# Altium schematic sheet Current_measurement_circuit.SchDoc
size A4; SheetNumber: 6; SheetTotal: 6
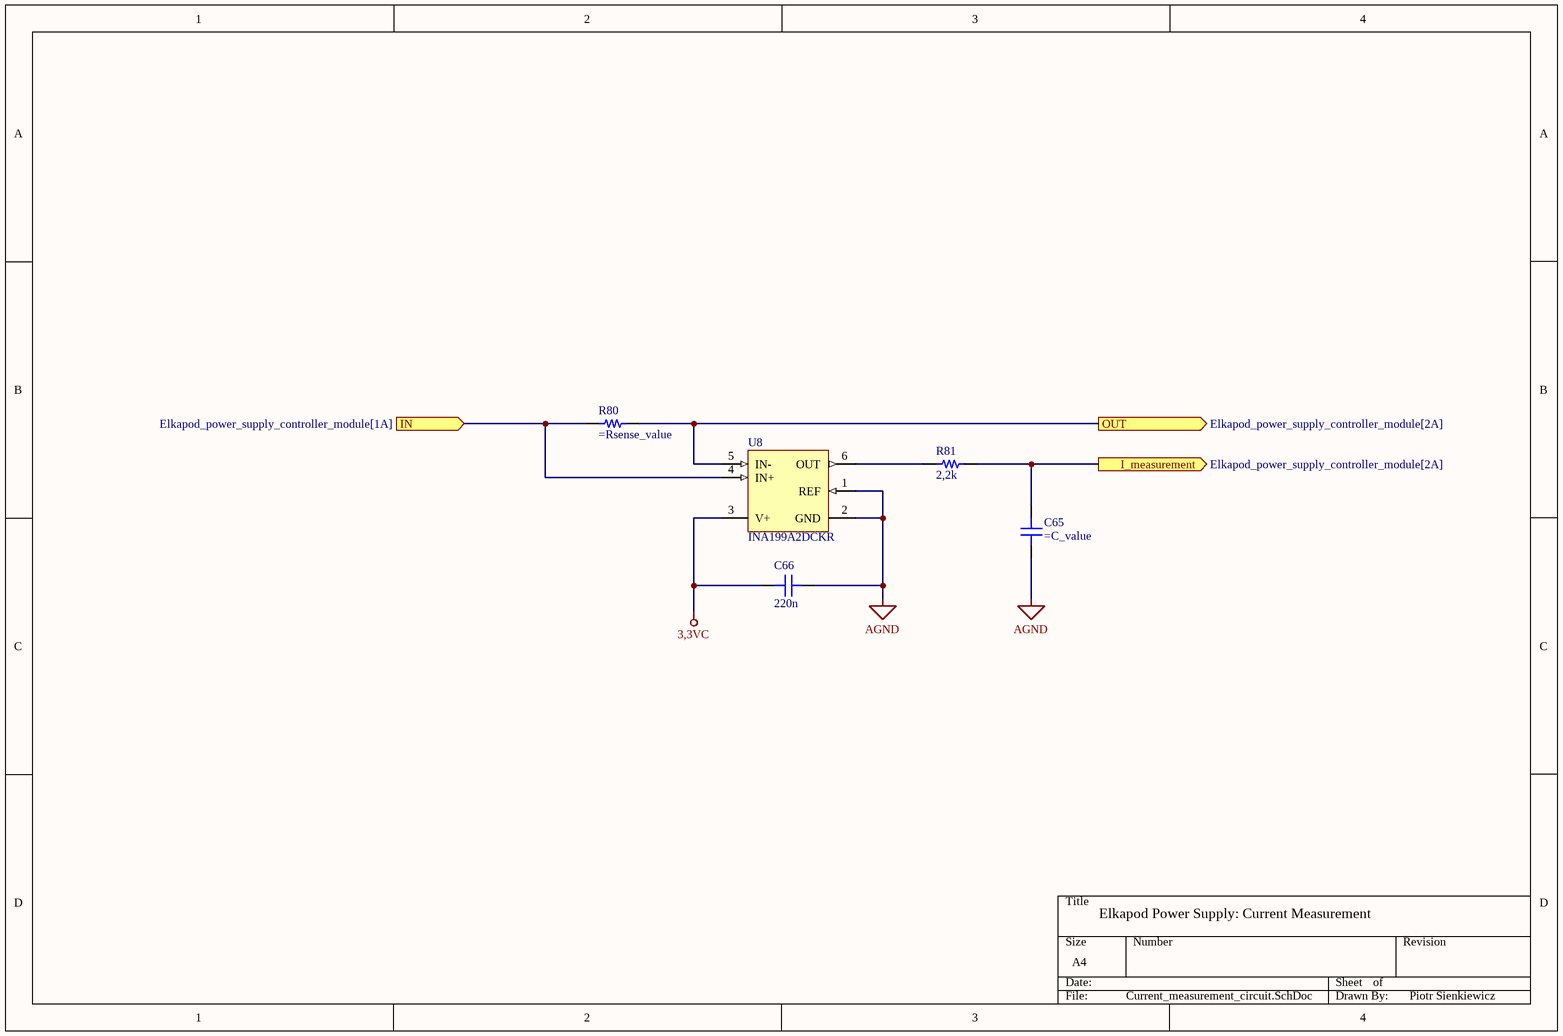
[diagram p0: Current_measurement_circuit.SchDoc]

## Parts
C65  (no value)  [CAP 0603_1608]
C66  220n  [CAP 0603_1608]
R80  (no value)  [STACKPOLE CSM2512]
R81  2,2k  [RES 0603_1608]
U8  INA199A2DCKR  [DCK0006A_N]

## Ports
I_measurement (out, see Elkapod_power_supply_controller_module[2A]), IN (in, see Elkapod_power_supply_controller_module[1A]), OUT (out, see Elkapod_power_supply_controller_module[2A])

## Nets
3,3VC: C66.2 U8.3(V+)
AGND: C65.1 C66.1 U8.1(REF) U8.2(GND)
I_measurement: C65.2 R81.2 ; port I_measurement
IN: R80.2 U8.4(IN+) ; port IN
OUT: R80.1 U8.5(IN-) ; port OUT
NetR81_1: R81.1 U8.6(OUT)

## Notes on the sheet
- Elkapod Power Supply: Current Measurement
- Piotr Sienkiewicz

## Library data of the parts
C65 = C0603C272F3GAC7867: CAP CER ??uF 35V X5R 0603; manufacturer: KEMET; Temperature Coefficient: C0G, NP0; Tolerance: ±1%; Voltage - Rated: 25V; Part Number: C0603C272F3GAC7867; Value: =C_value; Applications: General Purpose; Capacitance: =C_value; componentlink1description: Datasheet; componentlink1url: https://api.kemet.com/component-edge/download/datasheet/C0603C272F3GACTU.pdf; componentlink2description: DigiKey Link; componentlink2url: https://www.digikey.com/en/products/detail/kemet/C0603C272F3GAC7867/2200413; Device Package: 0603 (1608 Metric); Features: Low ESL; lastupdated: 09.02.2024 20:10:30; Lifecycle Status: Active; Minimum Order: 1; Mounting Type: Surface Mount, MLCC; Operating Temperature: -55°C ~ 125°C; Package / Case: 0603 (1608 Metric); packaging: TapeAndReel; partid: 2138; Part Status: Active; price: 0.40; series: SMD Comm C0G; Size / Dimension: 0.063" L x 0.031" W (1.60mm x 0.80mm); Thickness (Max): 0.034" (0.87mm)
C66 = C0603C272F3GAC7867: CAP CER 220nF 25V X5R 0603; manufacturer: KEMET; Temperature Coefficient: C0G, NP0; Tolerance: ±1%; Part Number: C0603C272F3GAC7867; Value: 220n; Applications: General Purpose; Capacitance: 220n; componentlink1description: Datasheet; componentlink1url: https://api.kemet.com/component-edge/download/datasheet/C0603C272F3GACTU.pdf; componentlink2description: DigiKey Link; componentlink2url: https://www.digikey.com/en/products/detail/kemet/C0603C272F3GAC7867/2200413; Device Package: 0603 (1608 Metric); Features: Low ESL; lastupdated: 09.02.2024 20:10:30; Lifecycle Status: Active; Minimum Order: 1; Mounting Type: Surface Mount, MLCC; Operating Temperature: -55°C ~ 125°C; Package / Case: 0603 (1608 Metric); packaging: TapeAndReel; partid: 2138; Part Status: Active; price: 0.40; series: SMD Comm C0G; Size / Dimension: 0.063" L x 0.031" W (1.60mm x 0.80mm); Thickness (Max): 0.034" (0.87mm); Voltage - Rated: 25V
R80 = CSM2512FT20L0: RES 1% 3W 2512; manufacturer: Stackpole Electronics Inc; Temperature Coefficient: ±50ppm/°C; value: 20 mOhms; Part Number: CSM2512FT20L0; componentlink1description: Datasheet; componentlink1url: https://www.seielect.com/Catalog/SEI-CSM.PDF; componentlink2description: DigiKey Link; componentlink2url: https://www.digikey.com/en/products/detail/stackpole-electronics-inc/CSM2512FT20L0/6270239; Composition: Metal Element; Device Package: 2512 (6332 Metric); Features: Current Sense; Height - Seated (Max): 0.035" (0.90mm); lastupdated: 03.06.2024 20:27:03; Lifecycle Status: Active; Minimum Order: 4000; Number of Terminations: 2; Operating Temperature: -55°C ~ 170°C; Package / Case: 2512 (6332 Metric); packaging: TapeAndReel; Part Status: Active; Power (Watts): 3W; price: 0.19; Resistance: =Rsense_value; series: CSM; Size / Dimension: 0.252" L x 0.126" W (6.40mm x 3.20mm); Supplier Device Package: 2512; Tolerance: ±1%
R81 = RNCS0603BKE10K0: RES 2,2K OHM 1% 0,1W 0603; Manufacturer: Stackpole Electronics Inc; Power (Watts): 0.063W, 1/16W; Temperature Coefficient: ±25ppm/°C; Tolerance: ±0.1%; Part Number: RNCS0603BKE10K0; Value: 2,2k; Composition: Thin Film; Device Package: 0603 (1608 Metric); Features: Anti-Corrosive, Automotive AEC-Q200, Moisture Resistant; Height - Seated (Max): 0.022" (0.55mm); LastUpdated: 09.02.2024 20:43:37; Lifecycle Status: Active; Minimum Order: 1; Number of Terminations: 2; Operating Temperature: -55°C ~ 155°C; Package / Case: 0603 (1608 Metric); Packaging: TapeAndReel; PartId: 4838; Part Status: Active; Price: 0.06; Ratings: AEC-Q200; Resistance: 2,2k; Series: RNCS; Size / Dimension: 0.061" L x 0.031" W (1.55mm x 0.80mm); Supplier Device Package: 0603
U8 = CMP-0704-00046-2: Voltage Output, High or Low Side Measurement, Bi-Directional Zero-Drift Series, 2.7 to 26 V, -40 to 125 degC, 6-pin SOT23 (DCK6), Green (RoHS & no Sb/Br); Rating: Catalog; CMRR(Min)(dB): 100; Quiescent Current (+/-)(Typ)(mA): 0.065; Input Offset Drift (+/-)(Max)(uV/Degrees Celsius): 0.5; Vs(Max)(V): 26; SubFamily: Current Shunt Monitor; Small-Signal Bandwidth(Typ)(MHz): 0.03; Vs(Min)(V): 2.7; Input Offset (+/-)(Max)(uV): 150; Common Mode Range(Min)(V): -0.3; PackageVersion: 4093553-4/G, 01/2007; PartNumber: INA199A2DCKR; DatasheetVersion: SBOS469D; ComponentLink2URL: http://www.ti.com/general/docs/lit/getliterature.tsp?genericPartNumber=INA199A2&fileType=pdf; Gain(V/V): 100; ComponentLink1Description: Manufacturer URL; PackageReference: DCK0006A; ComponentLink3Description: Package Specification; ComponentLink1URL: http://www.ti.com/; ComponentLink3URL: http://www.ti.com/lit/ds/symlink/ina212-q1.pdf; ComponentLink2Description: Datasheet; PackageDescription: 6-Pin Plastic Small Outline, Body 2 x 1.25 mm, Pitch 0.65 mm; Common Mode Range(Max)(V): 26; Mounting Technology: Surface Mount; Output Type: Voltage; Code_JEDEC: MO-203; Eco-Plan: Green (RoHS & no Sb/Br)